# Altium project 3Phase_Power_Meter.PrjPcb
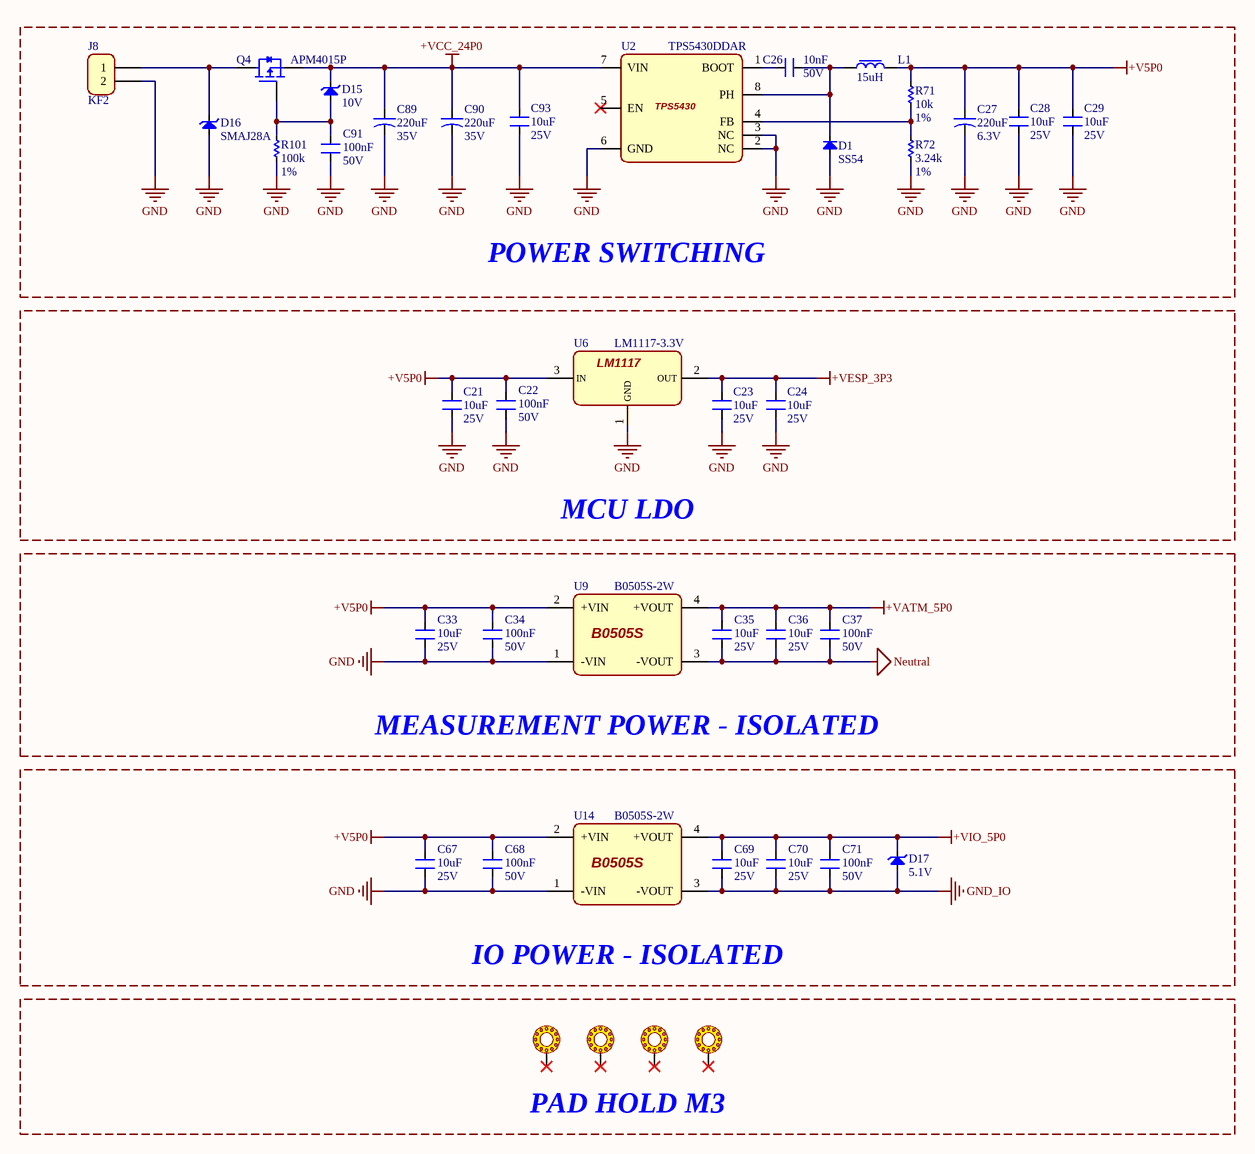
[diagram p0: Power Supply.SchDoc]
4 sheets, 252 parts. Net scope: flat (ports and power ports of the same name join across sheets).
Board file: PCB.PcbDoc
Sheets:
  Power Supply.SchDoc
  Poly Phase Metering.SchDoc
  Core.SchDoc
  Network.SchDoc

## Sheet Power Supply.SchDoc
size A3; SheetNumber: 2; SheetTotal: 6

### Parts
(Parts that share a designator on the sheet are numbered #1, #2 ... from top to bottom, then left to right.)
C21  Rating: 25V  [CAP_SMD_1206]  (hidden comment: 10uF)
C22  Rating: 50V  [CAP_SMD_0603]  (hidden comment: 100nF)
C23  Rating: 25V  [CAP_SMD_1206]  (hidden comment: 10uF)
C24  Rating: 25V  [CAP_SMD_1206]  (hidden comment: 10uF)
C26  Rating: 50V  [CAP_SMD_0603]  (hidden comment: 10nF)
C27  Rating: 6.3V  [TANT 2312]  (hidden comment: 220uF)
C28  Rating: 25V  [CAP_SMD_1206]  (hidden comment: 10uF)
C29  Rating: 25V  [CAP_SMD_1206]  (hidden comment: 10uF)
C33  Rating: 25V  [CAP_SMD_0603]  (hidden comment: 10uF)
C34  Rating: 50V  [CAP_SMD_0603]  (hidden comment: 100nF)
C35  Rating: 25V  [CAP_SMD_0603]  (hidden comment: 10uF)
C36  Rating: 25V  [CAP_SMD_0603]  (hidden comment: 10uF)
C37  Rating: 50V  [CAP_SMD_0603]  (hidden comment: 100nF)
C67  Rating: 25V  [CAP_SMD_0603]  (hidden comment: 10uF)
C68  Rating: 50V  [CAP_SMD_0603]  (hidden comment: 100nF)
C69  Rating: 25V  [CAP_SMD_0603]  (hidden comment: 10uF)
C70  Rating: 25V  [CAP_SMD_0603]  (hidden comment: 10uF)
C71  Rating: 50V  [CAP_SMD_0603]  (hidden comment: 100nF)
C89  Rating: 35V  [TANT 2312]  (hidden comment: 220uF)
C90  Rating: 35V  [TANT 2312]  (hidden comment: 220uF)
C91  Rating: 50V  [CAP_SMD_0603]  (hidden comment: 100nF)
C93  Rating: 25V  [CAP_SMD_1206]  (hidden comment: 10uF)
D1  SS54  [DIO-SMD-A]
D15  10V  [DIO-0.5A-SMALL]
D16  SMAJ28A  [DIO-SMD-A]
D17  5.1V  [DIO-0.5A-SMALL]
H1  HOLD  [M3-VIA]  (value not drawn)
H2  HOLD  [M3-VIA]  (value not drawn)
H3  HOLD  [M3-VIA]  (value not drawn)
H4  HOLD  [M3-VIA]  (value not drawn)
J8  KF2  [KF2-5.08X]
L1  15uH  [SRP7030]
Q4  APM4015P  [TO252-123]
R71  Tolerance: 1%  [RES_SMD_0603]  (hidden comment: 10k)
R72  Tolerance: 1%  [RES_SMD_0603]  (hidden comment: 3.24k)
R101#1  Tolerance: 1%  [RES_SMD_0603]  (hidden comment: 100k)
U2  TPS5430DDAR  [SOIC-8-EP]
U6  LM1117-3.3V  [SOT223-4]
U9  B0505S-2W  [SIP,19.6x7mm]
U14  B0505S-2W  [SIP,19.6x7mm]

### Blocks framed on the sheet
POWER SWITCHING: C26-C29 C89-C91 C93 D1 D15 D16 J8 L1 Q4 R71 R72 R101#1 U2
MCU LDO: C21-C24 U6
MEASUREMENT POWER - ISOLATED: C33-C37 U9
IO POWER - ISOLATED: C67-C71 D17 U14
PAD HOLD M3: H1-H4

### Nets
+V5P0: C21.1 C22.2 C27.1 C28.1 C29.1 C33.2 C34.2 C67.2 C68.2 L1.2 R71.2 U6.3(IN) U9.2(+VIN) U14.2(+VIN)
+VATM_5P0: C35.2 C36.2 C37.2 U9.4(+VOUT)
+VCC_24P0: C89.1 C90.1 C93.1 D15.2(K) Q4.2 U2.7(VIN)
+VESP_3P3: C23.1 C24.1 U6.2(OUT)
+VIO_5P0: C69.2 C70.2 C71.2 D17.2(K) U14.4(+VOUT)
GND: C21.2 C22.1 C23.2 C24.2 C27.2 C28.2 C29.2 C33.1 C34.1 C67.1 C68.1 C89.2 C90.2 C91.1 C93.2 D1.1(A) D16.1(A) J8.2 R72.1 R101#1.1 U2.2(NC) U2.3(NC) U2.6(GND) U6.1(GND) U9.1(-VIN) U14.1(-VIN)
GND_IO: C69.1 C70.1 C71.1 D17.1(A) U14.3(-VOUT)
Neutral: C35.1 C36.1 C37.1 U9.3(-VOUT)
NetC26_1: C26.1 D1.2(K) L1.1 U2.8(PH)
NetC26_2: C26.2 U2.1(BOOT)
NetC91_2: C91.2 D15.1(A) Q4.1 R101#1.2
NetD16_2: D16.2(K) J8.1 Q4.3
NetR71_1: R71.1 R72.2 U2.4(FB)

Not connected (* = marked no-connect by the designer): H1 1*; H2 1*; H3 1*; H4 1*; U2 5(EN)*

### Library data of the parts
C21-C24 C26 C28 C29 C33-C37 C67-C71 C91 C93 = CN: PN: *; LCSC: *
  C21 C23 C24 C28 C29 C33 C35 C36 C67 C69 C70 C93: Value: 10uF
  C22 C34 C37 C68 C71 C91: Value: 100nF
  C26: Value: 10nF
C27 C89 C90 = CN-TANTALUM: LCSC: *; PN: *; Value: 220uF
D1 = Diode SMD: Default Diode; LCSC: C22452; PN: SS54; Value: SS54
D15 D17 = DIODE Zener: Zenner; PN: *; LCSC: *
  D15: Value: 10V
  D17: Value: 5.1V
D16 = TVS DIODE: PN: *; LCSC: *; Value: SMAJ28A
H1-H4 = PAD_HOLD
J8 = KF2: ComponentLink1 Description: Manufacturer; ComponentLink2 Description: Datasheet; Manufacturer: *; ComponentLink1URL: http://www.we-online.com; ComponentLink2URL: http://katalog.we-online.de/em/datasheet/6911031100xx.pdf; LCSC: *; PN: *; Value: KF2
L1 = INDUCTOR: PN: MDA7030-150M; LCSC: C2847486; Value: 15uH
Q4 = FET-P: PN: *; LCSC: *; Value: APM4015P
R71 R72 R101#1 = Res-SMD: Resistor; PN: *; LCSC: *
  R71: Value: 10k
  R72: Value: 3.24k
  R101#1: Value: 100k
U2 = TPS5430: -40℃~+125℃@(TJ) 1 1.221V~32.04V 3A 4.4mA 5.5V~36V 500kHz Adjustable Buck Buck Built-in No SOIC-8-EP DC-DC Converters ROHS; LCSC: C9864; PN: TPS5430DDAR; Value: TPS5430DDAR
U6 = LM1117: 800mA Low-Dropout Linear Regulator; PN: LM1117MPX-3.3/NOPB; LCSC: C9662; Value: LM1117-3.3V
U9 U14 = B0505S: -40℃~+85℃ 1 1.5kV 100kHz 2W 4.5V~5.5V 400mA 5V 75mVp-p 84% Short Circuit Protection SIP,19.6x7mm Isolated Power Modules ROHS; LCSC: C387593; PN: B0505S-2W; Value: B0505S-2W

## Sheet Poly Phase Metering.SchDoc
size A3; SheetNumber: 3; SheetTotal: 6
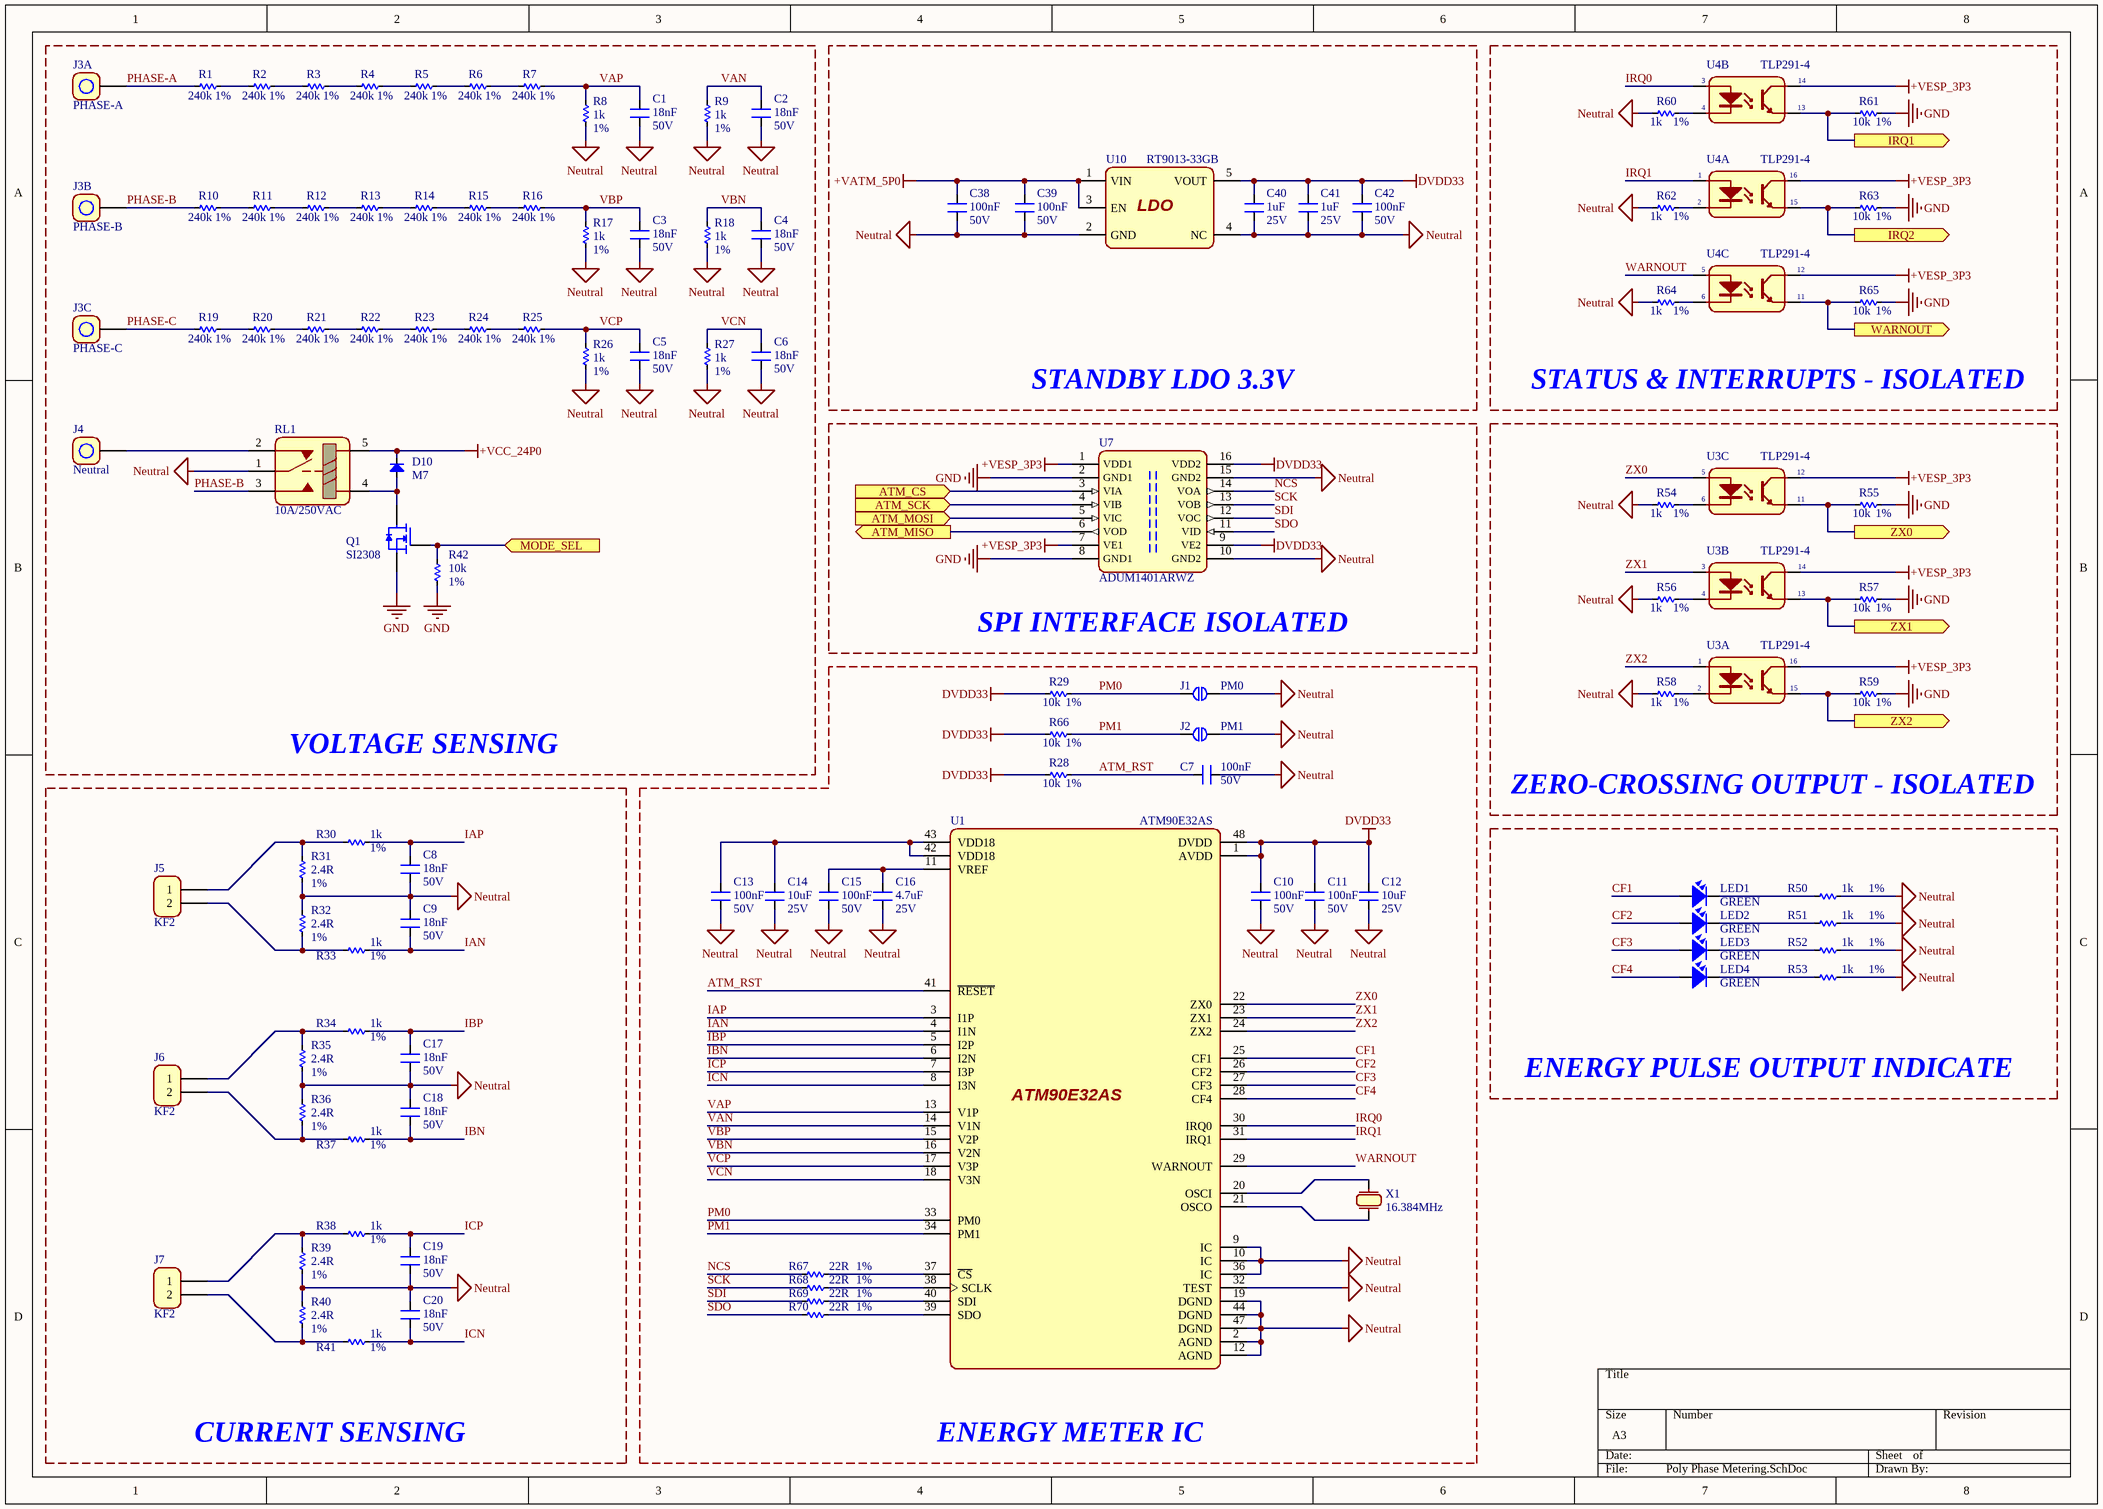
[diagram p1: Poly Phase Metering.SchDoc]

### Parts
C1  Rating: 50V  [CAP_SMD_1206]  (hidden comment: 18nF)
C2  Rating: 50V  [CAP_SMD_1206]  (hidden comment: 18nF)
C3  Rating: 50V  [CAP_SMD_1206]  (hidden comment: 18nF)
C4  Rating: 50V  [CAP_SMD_1206]  (hidden comment: 18nF)
C5  Rating: 50V  [CAP_SMD_1206]  (hidden comment: 18nF)
C6  Rating: 50V  [CAP_SMD_1206]  (hidden comment: 18nF)
C7  Rating: 50V  [CAP_SMD_0603]  (hidden comment: 100nF)
C8  Rating: 50V  [CAP_SMD_1206]  (hidden comment: 18nF)
C9  Rating: 50V  [CAP_SMD_1206]  (hidden comment: 18nF)
C10  Rating: 50V  [CAP_SMD_0603]  (hidden comment: 100nF)
C11  Rating: 50V  [CAP_SMD_0603]  (hidden comment: 100nF)
C12  Rating: 25V  [CAP_SMD_0603]  (hidden comment: 10uF)
C13  Rating: 50V  [CAP_SMD_0603]  (hidden comment: 100nF)
C14  Rating: 25V  [CAP_SMD_0603]  (hidden comment: 10uF)
C15  Rating: 50V  [CAP_SMD_0603]  (hidden comment: 100nF)
C16  Rating: 25V  [CAP_SMD_0603]  (hidden comment: 4.7uF)
C17  Rating: 50V  [CAP_SMD_1206]  (hidden comment: 18nF)
C18  Rating: 50V  [CAP_SMD_1206]  (hidden comment: 18nF)
C19  Rating: 50V  [CAP_SMD_1206]  (hidden comment: 18nF)
C20  Rating: 50V  [CAP_SMD_1206]  (hidden comment: 18nF)
C38  Rating: 50V  [CAP_SMD_0603]  (hidden comment: 100nF)
C39  Rating: 50V  [CAP_SMD_0603]  (hidden comment: 100nF)
C40  Rating: 25V  [CAP_SMD_0603]  (hidden comment: 1uF)
C41  Rating: 25V  [CAP_SMD_0603]  (hidden comment: 1uF)
C42  Rating: 50V  [CAP_SMD_0603]  (hidden comment: 100nF)
D10  M7  [DIO-SMD-A]
J1  PM0  [SOLDER_JUMP_2]
J2  PM1  [SOLDER_JUMP_2]
J3  PHASE-A  [Plugin,P=9.5mm]  (parts A,B,C of 3)
J4  Neutral  [Plugin-2,P=9.5mm]
J5  KF2  [KF2-5.08X]
J6  KF2  [KF2-5.08X]
J7  KF2  [KF2-5.08X]
LED1  GREEN  [GREENLED_0603]
LED2  GREEN  [GREENLED_0603]
LED3  GREEN  [GREENLED_0603]
LED4  GREEN  [GREENLED_0603]
Q1  SI2308  [SOT23-132]
R1  Tolerance: 1%  [RES_SMD_1206]  (hidden comment: 240k)
R2  Tolerance: 1%  [RES_SMD_1206]  (hidden comment: 240k)
R3  Tolerance: 1%  [RES_SMD_1206]  (hidden comment: 240k)
R4  Tolerance: 1%  [RES_SMD_1206]  (hidden comment: 240k)
R5  Tolerance: 1%  [RES_SMD_1206]  (hidden comment: 240k)
R6  Tolerance: 1%  [RES_SMD_1206]  (hidden comment: 240k)
R7  Tolerance: 1%  [RES_SMD_1206]  (hidden comment: 240k)
R8  Tolerance: 1%  [RES_SMD_1206]  (hidden comment: 1k)
R9  Tolerance: 1%  [RES_SMD_1206]  (hidden comment: 1k)
R10  Tolerance: 1%  [RES_SMD_1206]  (hidden comment: 240k)
R11  Tolerance: 1%  [RES_SMD_1206]  (hidden comment: 240k)
R12  Tolerance: 1%  [RES_SMD_1206]  (hidden comment: 240k)
R13  Tolerance: 1%  [RES_SMD_1206]  (hidden comment: 240k)
R14  Tolerance: 1%  [RES_SMD_1206]  (hidden comment: 240k)
R15  Tolerance: 1%  [RES_SMD_1206]  (hidden comment: 240k)
R16  Tolerance: 1%  [RES_SMD_1206]  (hidden comment: 240k)
R17  Tolerance: 1%  [RES_SMD_1206]  (hidden comment: 1k)
R18  Tolerance: 1%  [RES_SMD_1206]  (hidden comment: 1k)
R19  Tolerance: 1%  [RES_SMD_1206]  (hidden comment: 240k)
R20  Tolerance: 1%  [RES_SMD_1206]  (hidden comment: 240k)
R21  Tolerance: 1%  [RES_SMD_1206]  (hidden comment: 240k)
R22  Tolerance: 1%  [RES_SMD_1206]  (hidden comment: 240k)
R23  Tolerance: 1%  [RES_SMD_1206]  (hidden comment: 240k)
R24  Tolerance: 1%  [RES_SMD_1206]  (hidden comment: 240k)
R25  Tolerance: 1%  [RES_SMD_1206]  (hidden comment: 240k)
R26  Tolerance: 1%  [RES_SMD_1206]  (hidden comment: 1k)
R27  Tolerance: 1%  [RES_SMD_1206]  (hidden comment: 1k)
R28  Tolerance: 1%  [RES_SMD_0603]  (hidden comment: 10k)
R29  Tolerance: 1%  [RES_SMD_0603]  (hidden comment: 10k)
R30  Tolerance: 1%  [RES_SMD_1206]  (hidden comment: 1k)
R31  Tolerance: 1%  [RES_SMD_1206]  (hidden comment: 2.4R)
R32  Tolerance: 1%  [RES_SMD_1206]  (hidden comment: 2.4R)
R33  Tolerance: 1%  [RES_SMD_1206]  (hidden comment: 1k)
R34  Tolerance: 1%  [RES_SMD_1206]  (hidden comment: 1k)
R35  Tolerance: 1%  [RES_SMD_1206]  (hidden comment: 2.4R)
R36  Tolerance: 1%  [RES_SMD_1206]  (hidden comment: 2.4R)
R37  Tolerance: 1%  [RES_SMD_1206]  (hidden comment: 1k)
R38  Tolerance: 1%  [RES_SMD_1206]  (hidden comment: 1k)
R39  Tolerance: 1%  [RES_SMD_1206]  (hidden comment: 2.4R)
R40  Tolerance: 1%  [RES_SMD_1206]  (hidden comment: 2.4R)
R41  Tolerance: 1%  [RES_SMD_1206]  (hidden comment: 1k)
R42  Tolerance: 1%  [RES_SMD_0603]  (hidden comment: 10k)
R50  Tolerance: 1%  [RES_SMD_0603]  (hidden comment: 1k)
R51  Tolerance: 1%  [RES_SMD_0603]  (hidden comment: 1k)
R52  Tolerance: 1%  [RES_SMD_0603]  (hidden comment: 1k)
R53  Tolerance: 1%  [RES_SMD_0603]  (hidden comment: 1k)
R54  Tolerance: 1%  [RES_SMD_0603]  (hidden comment: 1k)
R55  Tolerance: 1%  [RES_SMD_0603]  (hidden comment: 10k)
R56  Tolerance: 1%  [RES_SMD_0603]  (hidden comment: 1k)
R57  Tolerance: 1%  [RES_SMD_0603]  (hidden comment: 10k)
R58  Tolerance: 1%  [RES_SMD_0603]  (hidden comment: 1k)
R59  Tolerance: 1%  [RES_SMD_0603]  (hidden comment: 10k)
R60  Tolerance: 1%  [RES_SMD_0603]  (hidden comment: 1k)
R61  Tolerance: 1%  [RES_SMD_0603]  (hidden comment: 10k)
R62  Tolerance: 1%  [RES_SMD_0603]  (hidden comment: 1k)
R63  Tolerance: 1%  [RES_SMD_0603]  (hidden comment: 10k)
R64  Tolerance: 1%  [RES_SMD_0603]  (hidden comment: 1k)
R65  Tolerance: 1%  [RES_SMD_0603]  (hidden comment: 10k)
R66  Tolerance: 1%  [RES_SMD_0603]  (hidden comment: 10k)
R67  Tolerance: 1%  [RES_SMD_0603]  (hidden comment: 22R)
R68  Tolerance: 1%  [RES_SMD_0603]  (hidden comment: 22R)
R69  Tolerance: 1%  [RES_SMD_0603]  (hidden comment: 22R)
R70  Tolerance: 1%  [RES_SMD_0603]  (hidden comment: 22R)
RL1  10A/250VAC  [SRA-05VDC-CL]
U1  ATM90E32AS  [TQFP48]
U3  TLP291-4  [SOP-16-4.4mm]  (parts A,B,C of 4)
U4  TLP291-4  [SOP-16-4.4mm]  (parts A,B,C of 4)
U7  ADUM1401ARWZ  [SOIC-16-300mil]
U10  RT9013-33GB  [SOT23-5]
X1  16.384MHz  [XT2-SMD]

### Blocks framed on the sheet
VOLTAGE SENSING: C1-C6 D10 J3 J4 Q1 R1-R27 R42 RL1
STANDBY LDO 3.3V: C38-C42 U10
STATUS & INTERRUPTS - ISOLATED: R60-R65 U4
SPI INTERFACE ISOLATED: U7
ZERO-CROSSING OUTPUT - ISOLATED: R54-R59 U3
ENERGY METER IC: C7 C10-C16 J1 J2 R28 R29 R66-R70 U1 X1
CURRENT SENSING: C8 C9 C17-C20 J5-J7 R30-R41
ENERGY PULSE OUTPUT INDICATE: LED1-LED4 R50-R53

### Ports
ATM_CS (in, see Architecture[4A]), ATM_MISO (out, see Architecture[4A]), ATM_MOSI (in, see Architecture[4A]), ATM_SCK (in, see Architecture[4A]), IRQ1 (out, see Architecture[4B]), IRQ2 (out, see Architecture[4B]), MODE_SEL (in, see Architecture[4A]), WARNOUT (out, see Architecture[4B]), ZX0 (out, see Architecture[4B]), ZX1 (out, see Architecture[4B]), ZX2 (out, see Architecture[4B])

### Nets
+VATM_5P0: C38.2 C39.2 U10.1(VIN) U10.3(EN)
+VCC_24P0: D10.2(K) RL1.5
+VESP_3P3: U3.12(C) U3.14(C) U3.16(C) U4.12(C) U4.14(C) U4.16(C) U7.1(VDD1) U7.7(VE1)
DVDD33: C10.2 C11.2 C12.2 C40.2 C41.2 C42.2 R28.1 R29.1 R66.1 U1.1(AVDD) U1.48(DVDD) U7.9(VE2) U7.16(VDD2) U10.5(VOUT)
GND: Q1.2 R42.2 R55.2 R57.2 R59.2 R61.2 R63.2 R65.2 U7.2(GND1) U7.8(GND1)
Neutral: C1.1 C2.1 C3.1 C4.1 C5.1 C6.1 C7.1 C8.1 C9.2 C10.1 C11.1 C12.1 C13.1 C14.1 C15.1 C16.1 C17.1 C18.2 C19.1 C20.2 C38.1 C39.1 C40.1 C41.1 C42.1 J1.2 J2.2 R8.2 R9.2 R17.2 R18.2 R26.2 R27.2 R31.2 R32.1 R35.2 R36.1 R39.2 R40.1 R50.2 R51.2 R52.2 R53.2 R54.1 R56.1 R58.1 R60.1 R62.1 R64.1 RL1.1 U1.2(AGND) U1.9(IC) U1.10(IC) U1.12(AGND) U1.19(DGND) U1.32(TEST) U1.36(IC) U1.44(DGND) U1.47(DGND) U7.10(GND2) U7.15(GND2) U10.2(GND) U10.4(NC)
ATM_RST: C7.2 R28.2 U1.41(~{RESET})
CF1: LED1.1 U1.25(CF1)
CF2: LED2.1 U1.26(CF2)
CF3: LED3.1 U1.27(CF3)
CF4: LED4.1 U1.28(CF4)
IAN: C9.1 R33.1 U1.4(I1N)
IAP: C8.2 R30.1 U1.3(I1P)
IBN: C18.1 R37.1 U1.6(I2N)
IBP: C17.2 R34.1 U1.5(I2P)
ICN: C20.1 R41.1 U1.8(I3N)
ICP: C19.2 R38.1 U1.7(I3P)
IRQ0: U1.30(IRQ0) U4.3(A)
IRQ1: U1.31(IRQ1) U4.1(A)
NCS: R67.1 U7.14(VOA)
PHASE-A: J3.1(PHASE_A) R1.2
PHASE-B: J3.2(PHASE_A) R10.2 RL1.3
PHASE-C: J3.3(PHASE_A) R19.2
PM0: J1.1 R29.2 U1.33(PM0)
PM1: J2.1 R66.2 U1.34(PM1)
SCK: R68.1 U7.13(VOB)
SDI: R69.1 U7.12(VOC)
SDO: R70.1 U7.11(VID)
VAN: C2.2 R9.1 U1.14(V1N)
VAP: C1.2 R7.1 R8.1 U1.13(V1P)
VBN: C4.2 R18.1 U1.16(V2N)
VBP: C3.2 R16.1 R17.1 U1.15(V2P)
VCN: C6.2 R27.1 U1.18(V3N)
VCP: C5.2 R25.1 R26.1 U1.17(V3P)
WARNOUT: U1.29(WARNOUT) U4.5(A)
ZX0: U1.22(ZX0) U3.5(A)
ZX1: U1.23(ZX1) U3.3(A)
ZX2: U1.24(ZX2) U3.1(A)
NetC13_2: C13.2 C14.2 U1.42(VDD18) U1.43(VDD18)
NetC15_2: C15.2 C16.2 U1.11(VREF)
NetD10_1: D10.1(A) Q1.3 RL1.4
NetJ4_1, 2: J4.1,_2(PHASE_A) RL1.2
NetJ5_1: J5.1 R30.2 R31.1
NetJ5_2: J5.2 R32.2 R33.2
NetJ6_1: J6.1 R34.2 R35.1
NetJ6_2: J6.2 R36.2 R37.2
NetJ7_1: J7.1 R38.2 R39.1
NetJ7_2: J7.2 R40.2 R41.2
NetLED1_2: LED1.2 R50.1
NetLED2_2: LED2.2 R51.1
NetLED3_2: LED3.2 R52.1
NetLED4_2: LED4.2 R53.1
NetQ1_1: Q1.1 R42.1 ; port MODE_SEL
NetR1_1: R1.1 R2.2
NetR2_1: R2.1 R3.2
NetR3_1: R3.1 R4.2
NetR4_1: R4.1 R5.2
NetR5_1: R5.1 R6.2
NetR6_1: R6.1 R7.2
NetR10_1: R10.1 R11.2
NetR11_1: R11.1 R12.2
NetR12_1: R12.1 R13.2
NetR13_1: R13.1 R14.2
NetR14_1: R14.1 R15.2
NetR15_1: R15.1 R16.2
NetR19_1: R19.1 R20.2
NetR20_1: R20.1 R21.2
NetR21_1: R21.1 R22.2
NetR22_1: R22.1 R23.2
NetR23_1: R23.1 R24.2
NetR24_1: R24.1 R25.2
NetR54_2: R54.2 U3.6(K)
NetR55_1: R55.1 U3.11(E) ; port ZX0
NetR56_2: R56.2 U3.4(K)
NetR57_1: R57.1 U3.13(E) ; port ZX1
NetR58_2: R58.2 U3.2(K)
NetR59_1: R59.1 U3.15(E) ; port ZX2
NetR60_2: R60.2 U4.4(K)
NetR61_1: R61.1 U4.13(E) ; port IRQ1
NetR62_2: R62.2 U4.2(K)
NetR63_1: R63.1 U4.15(E) ; port IRQ2
NetR64_2: R64.2 U4.6(K)
NetR65_1: R65.1 U4.11(E) ; port WARNOUT
NetR67_2: R67.2 U1.37(~{CS})
NetR68_2: R68.2 U1.38(SCLK)
NetR69_2: R69.2 U1.40(SDI)
NetR70_2: R70.2 U1.39(SDO)
NetU1_20: U1.20(OSCI) X1.2
NetU1_21: U1.21(OSCO) X1.1
NetU7_3: U7.3(VIA) ; port ATM_CS
NetU7_4: U7.4(VIB) ; port ATM_SCK
NetU7_5: U7.5(VIC) ; port ATM_MOSI
NetU7_6: U7.6(VOD) ; port ATM_MISO

### Notes on the sheet
- (in symbol RT9013) LDO

### Library data of the parts
C1-C20 C38-C42 = CN: PN: *; LCSC: *
  C1-C6 C8 C9 C17-C20: Value: 18nF
  C7 C10 C11 C13 C15 C38 C39 C42: Value: 100nF
  C12 C14: Value: 10uF
  C16: Value: 4.7uF
  C40 C41: Value: 1uF
D10 = Diode SMD: Default Diode; LCSC: *; PN: *; Value: M7
J1 J2 = CNT: DNP; PN: DNP; LCSC: DNP
  J1: Value: PM0
  J2: Value: PM1
J3 = HB9500-3: Value: PHASE-A
J4 = HB9500-2: Value: Neutral
J5-J7 = KF2: as J8 on sheet Power Supply; Manufacturer: *; ComponentLink1URL: http://www.we-online.com; ComponentLink2URL: http://katalog.we-online.de/em/datasheet/6911031100xx.pdf; LCSC: *; PN: *; Value: KF2
LED1-LED4 = LED SMD: PN: *; LCSC: *; Value: GREEN
Q1 = FET-N: PN: *; LCSC: *; Value: SI2308
R1-R42 R50-R70 = Res-SMD: Resistor; PN: *; LCSC: *
  R1-R7 R10-R16 R19-R25: Value: 240k
  R8 R9 R17 R18 R26 R27 R30 R33 R34 R37 R38 R41 R50-R54 R56 R58 R60 R62 R64: Value: 1k
  R28 R29 R42 R55 R57 R59 R61 R63 R65 R66: Value: 10k
  R31 R32 R35 R36 R39 R40: Value: 2.4R
  R67-R70: Value: 22R
RL1 = Relay 5: Relay SPDT,10A - 12VDC 5 Pin; PN: SRA-05VDC-CL; LCSC: C99666; Value: 10A/250VAC
U1 = ATM90E32AS: PN: ATM90E32AS-AU-R; LCSC: C177153; Value: ATM90E32AS
U3 U4 = TLP291-4: -55℃~+110℃ 1.2V 170mW 2.5kV 2us 3us 4 400% 400mV@2.4mA,8mA 50% 50mA 50mA 5V 80V DC Phototransistor SOP-16-4.4mm Transistor, Photovoltaic Output Optoisolators ROHS; PN: TLP291-4(GB-TP,E); LCSC: C60900; Value: TLP291-4
U7 = ADUM1401: -40℃~+125℃ 1 100ns 1Mbps 2.7V~5.5V 2.7V~5.5V 2500 25kV/us 3 SOIC-16-300mil Digital Isolators ROHS; PN: ADUM1401ARWZ; LCSC: C579384; Value: ADUM1401ARWZ
U10 = RT9013: -40℃~+125℃@(Tj) 1 25uA 3.3V 30uVrms 400mV@(500mA) 5.5V 500mA 50dB@(10kHz) Fixed Over Current Protection、Over Temperature Protection、Enable Positive SOT-23-5 Voltage Regulators - Linear, Low Drop Out (LDO) Regulators ROHS; PN: RT9013-33GB; LCSC: C47773; Value: RT9013-33GB
X1 = XT2: LCSC: *; PN: *; Value: 16.384MHz

## Sheet Core.SchDoc
size A3; SheetNumber: 4; SheetTotal: 6
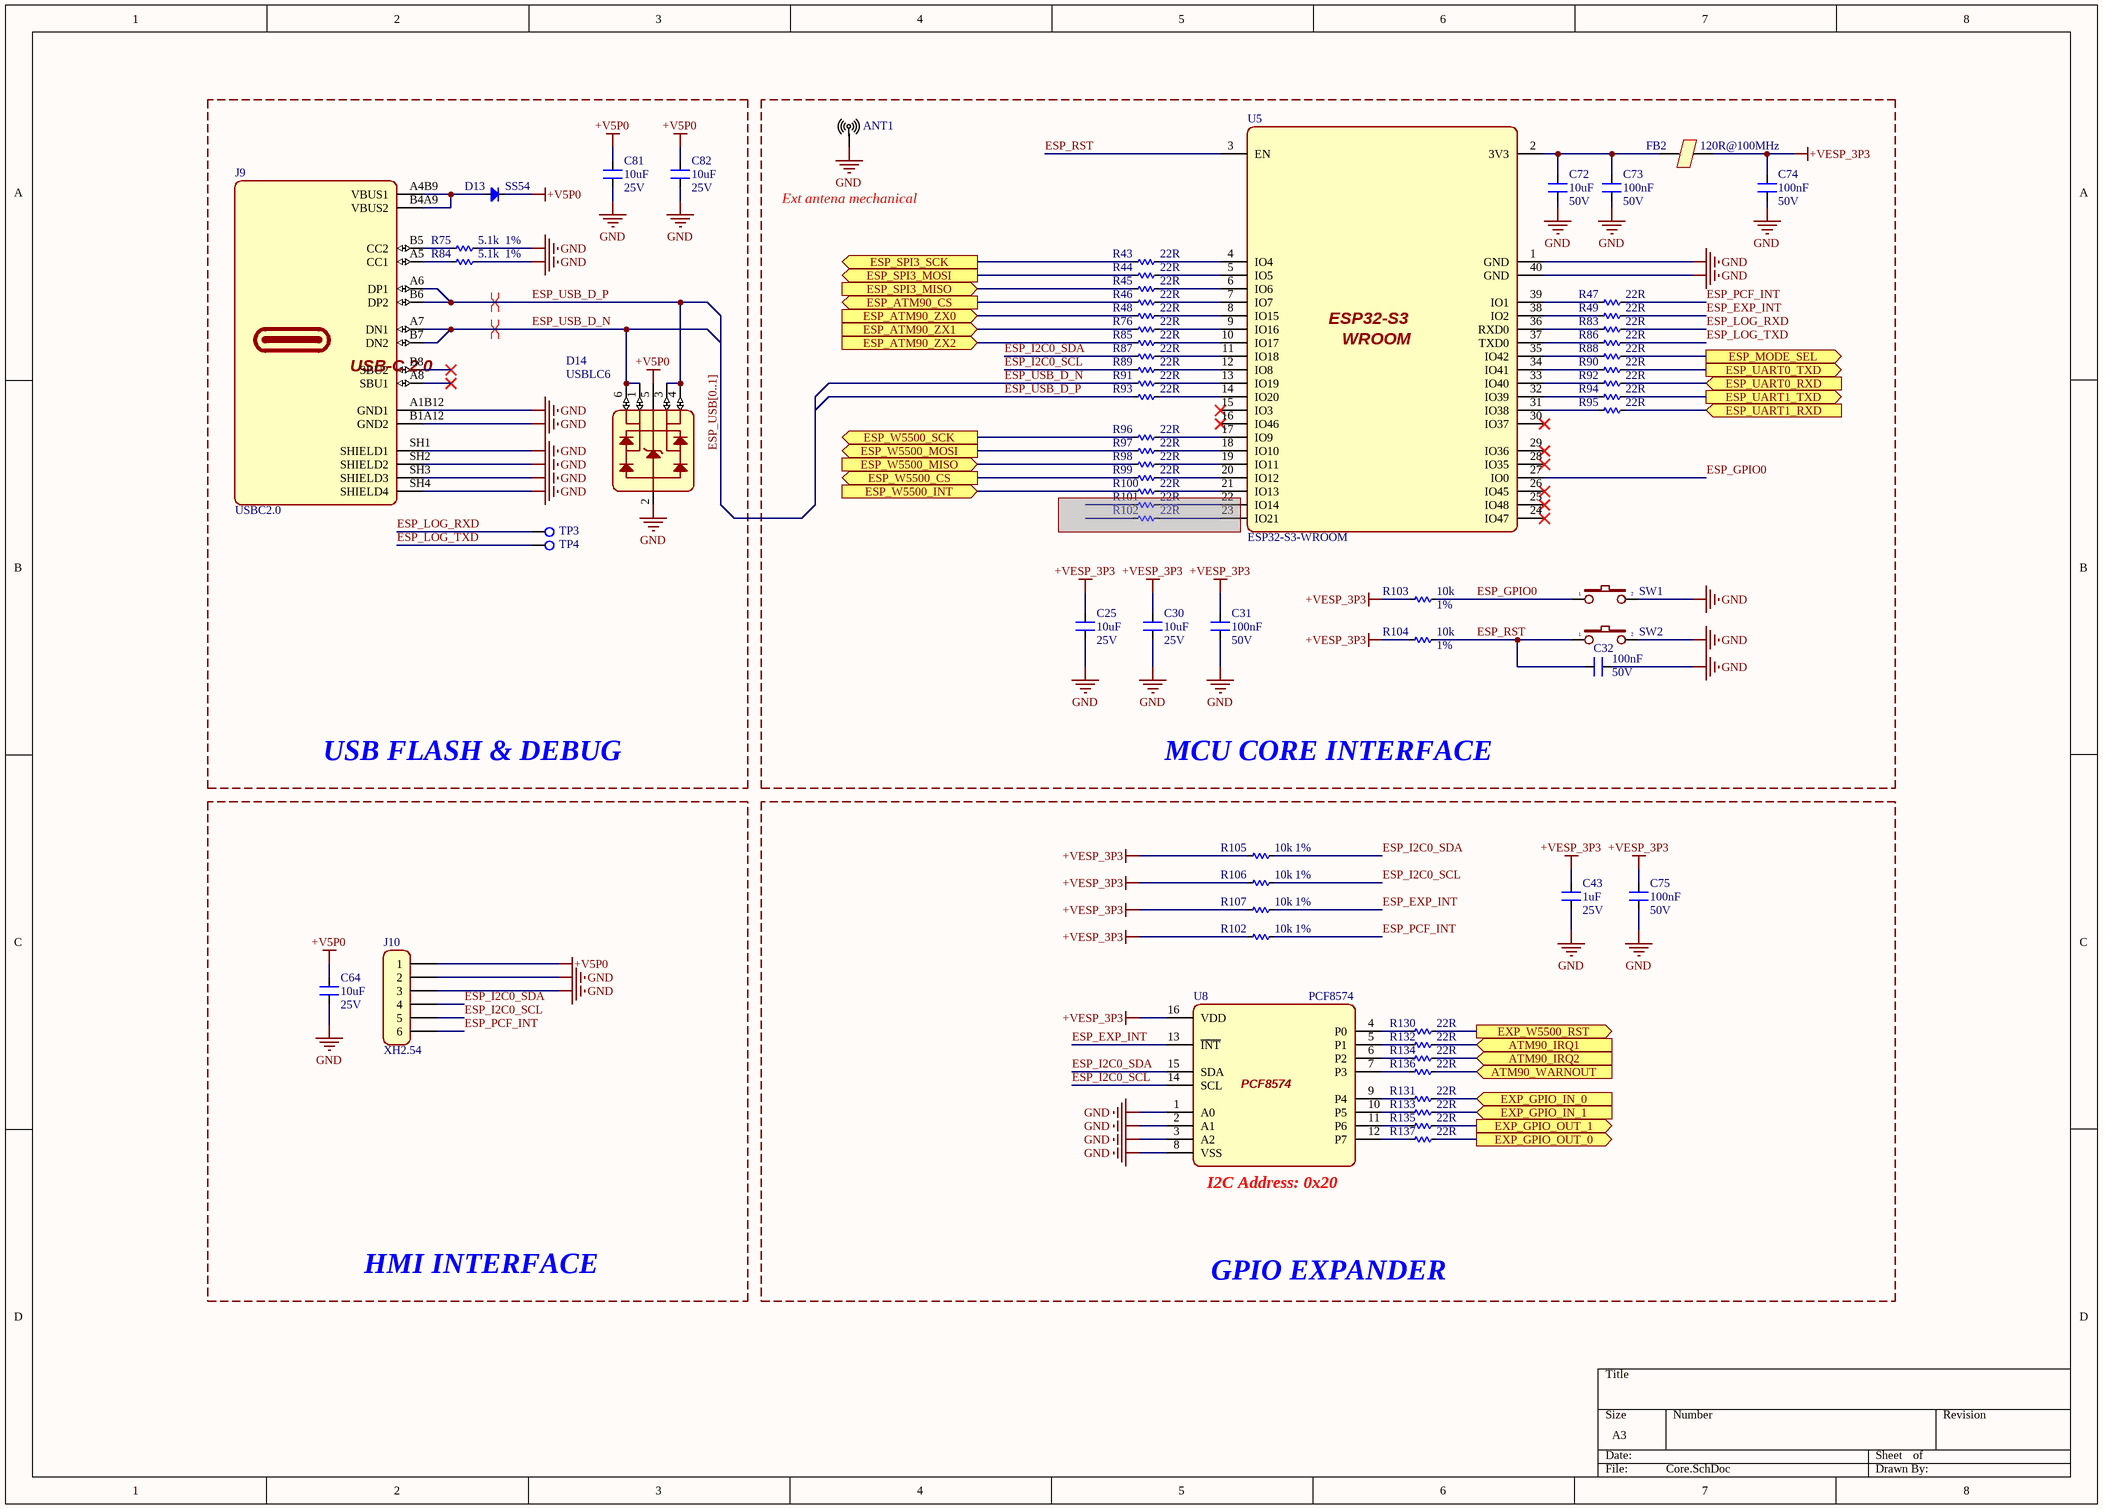
[diagram p2: Core.SchDoc]

### Parts
(Parts that share a designator on the sheet are numbered #1, #2 ... from top to bottom, then left to right.)
ANT1  Anten  [SMA-8.5mm]  (value not drawn)
C25  Rating: 25V  [CAP_SMD_0603]  (hidden comment: 10uF)
C30  Rating: 25V  [CAP_SMD_0603]  (hidden comment: 10uF)
C31  Rating: 50V  [CAP_SMD_0603]  (hidden comment: 100nF)
C32  Rating: 50V  [CAP_SMD_0603]  (hidden comment: 100nF)
C43  Rating: 25V  [CAP_SMD_0603]  (hidden comment: 1uF)
C64  Rating: 25V  [CAP_SMD_0603]  (hidden comment: 10uF)
C72  Rating: 50V  [CAP_SMD_0603]  (hidden comment: 10uF)
C73  Rating: 50V  [CAP_SMD_0603]  (hidden comment: 100nF)
C74  Rating: 50V  [CAP_SMD_0603]  (hidden comment: 100nF)
C75  Rating: 50V  [CAP_SMD_0603]  (hidden comment: 100nF)
C81  Rating: 25V  [CAP_SMD_0603]  (hidden comment: 10uF)
C82  Rating: 25V  [CAP_SMD_0603]  (hidden comment: 10uF)
D13  SS54  [DIO-SMD-A]
D14  USBLC6  [SOT23-6]
FB2  120R@100MHz  [FER 0805/2012]
J9  USBC2.0  [MOLEX-2171790001]
J10  XH2.54  [JP6-C1T]
R43  22R  [RES_SMD_0603]
R44  22R  [RES_SMD_0603]
R45  22R  [RES_SMD_0603]
R46  22R  [RES_SMD_0603]
R47  22R  [RES_SMD_0603]
R48  22R  [RES_SMD_0603]
R49  22R  [RES_SMD_0603]
R75  Tolerance: 1%  [RES_SMD_0603]  (hidden comment: 5.1k)
R76  22R  [RES_SMD_0603]
R83  22R  [RES_SMD_0603]
R84  Tolerance: 1%  [RES_SMD_0603]  (hidden comment: 5.1k)
R85  22R  [RES_SMD_0603]
R86  22R  [RES_SMD_0603]
R87  22R  [RES_SMD_0603]
R88  22R  [RES_SMD_0603]
R89  22R  [RES_SMD_0603]
R90  22R  [RES_SMD_0603]
R91  22R  [RES_SMD_0603]
R92  22R  [RES_SMD_0603]
R93  22R  [RES_SMD_0603]
R94  22R  [RES_SMD_0603]
R95  22R  [RES_SMD_0603]
R96  22R  [RES_SMD_0603]
R97  22R  [RES_SMD_0603]
R98  22R  [RES_SMD_0603]
R99  22R  [RES_SMD_0603]
R100  22R  [RES_SMD_0603]
R101#2  22R  [RES_SMD_0603]  (masked out: inside a compile mask, not in the netlist)
R102#1  22R  [RES_SMD_0603]  (masked out: inside a compile mask, not in the netlist)
R102#2  Tolerance: 1%  [RES_SMD_0603]  (hidden comment: 10k)
R103  Tolerance: 1%  [RES_SMD_0603]  (hidden comment: 10k)
R104  Tolerance: 1%  [RES_SMD_0603]  (hidden comment: 10k)
R105  Tolerance: 1%  [RES_SMD_0603]  (hidden comment: 10k)
R106  Tolerance: 1%  [RES_SMD_0603]  (hidden comment: 10k)
R107  Tolerance: 1%  [RES_SMD_0603]  (hidden comment: 10k)
R130  22R  [RES_SMD_0603]
R131  22R  [RES_SMD_0603]
R132  22R  [RES_SMD_0603]
R133  22R  [RES_SMD_0603]
R134  22R  [RES_SMD_0603]
R135  22R  [RES_SMD_0603]
R136  22R  [RES_SMD_0603]
R137  22R  [RES_SMD_0603]
SW1  SW2  [SW1-SMD]  (value not drawn)
SW2  SW2  [SW1-SMD]  (value not drawn)
TP3  Test_Point  [PAD-SMD-D2.0]  (value not drawn)
TP4  Test_Point  [PAD-SMD-D2.0]  (value not drawn)
U5  ESP32-S3-WROOM  [ESP32-S3-WROOM-1-N16R8]
U8  PCF8574  [SOIC-16-300mil]

### Blocks framed on the sheet
USB FLASH & DEBUG: C81 C82 D13 D14 J9 R75 R84 TP3 TP4
MCU CORE INTERFACE: ANT1 C25 C30-C32 C72-C74 FB2 R43-R49 R76 R83 R85-R100 R101#2 R102#1 R103 R104 SW1 SW2 U5
HMI INTERFACE: C64 J10
GPIO EXPANDER: C43 C75 R102#2 R105-R107 R130-R137 U8

### Ports
ATM90_IRQ1 (in, see Architecture[4B]), ATM90_IRQ2 (in, see Architecture[4B]), ATM90_WARNOUT (in, see Architecture[4B]), ESP_ATM90_CS (out, see Architecture[4A]), ESP_ATM90_ZX0 (in, see Architecture[4B]), ESP_ATM90_ZX1 (in, see Architecture[4B]), ESP_ATM90_ZX2 (in, see Architecture[4B]), ESP_MODE_SEL (out, see Architecture[4A]), ESP_SPI3_MISO (in, see Architecture[4A]), ESP_SPI3_MOSI (out, see Architecture[4A]), ESP_SPI3_SCK (out, see Architecture[4A]), ESP_UART0_RXD (in, see Architecture[6B]), ESP_UART0_TXD (out, see Architecture[6B]), ESP_UART1_RXD (in, see Architecture[6B]), ESP_UART1_TXD (out, see Architecture[6B]), ESP_W5500_CS (out, see Architecture[6A]), ESP_W5500_INT (in, see Architecture[6A]), ESP_W5500_MISO (in, see Architecture[6A]), ESP_W5500_MOSI (out, see Architecture[6A]), ESP_W5500_SCK (out, see Architecture[6A]), EXP_GPIO_IN_0 (in, see Architecture[6B]), EXP_GPIO_IN_1 (in, see Architecture[6B]), EXP_GPIO_OUT_0 (out, see Architecture[6B]), EXP_GPIO_OUT_1 (out, see Architecture[6B]), EXP_W5500_RST (out, see Architecture[6A])

### Nets
+V5P0: C64.1 C81.1 C82.1 D13.2(K) D14.5(VBUS) J10.1
+VESP_3P3: C25.1 C30.1 C31.1 C43.1 C74.1 C75.1 FB2.2 R102#2.1 R103.1 R104.1 R105.1 R106.1 R107.1 U8.16(VDD)
GND: ANT1.GND C25.2 C30.2 C31.2 C32.1 C43.2 C64.2 C72.2 C73.2 C74.2 C75.2 C81.2 C82.2 D14.2(GND) J9.A1B12(GND1) J9.B1A12(GND2) J9.SH1(SHIELD1) J9.SH2(SHIELD2) J9.SH3(SHIELD3) J9.SH4(SHIELD4) J10.2 J10.3 R75.2 R84.2 SW1.2 SW2.2 U5.1(GND) U5.40(GND) U8.1(A0) U8.2(A1) U8.3(A2) U8.8(VSS)
ESP_EXP_INT: R49.1 R107.2 U8.13(~{INT})
ESP_GPIO0: R103.2 SW1.1 U5.27(IO0)
ESP_I2C0_SCL: J10.5 R89.2 R106.2 U8.14(SCL)
ESP_I2C0_SDA: J10.4 R87.2 R105.2 U8.15(SDA)
ESP_LOG_RXD: R83.1 TP3.1
ESP_LOG_TXD: R86.1 TP4.1
ESP_PCF_INT: J10.6 R47.1 R102#2.2
ESP_RST: C32.2 R104.2 SW2.1 U5.3(EN)
ESP_USB_D_N: D14.1(I/O1_IN) D14.6(I/O1_OUT) J9.A7(DN1) J9.B7(DN2) R91.2
ESP_USB_D_P: D14.3(I/O2_IN) D14.4(I/O2_OUT) J9.A6(DP1) J9.B6(DP2) R93.2
NetC72_1: C72.1 C73.1 FB2.1 U5.2(3V3)
NetD13_1: D13.1(A) J9.A4B9(VBUS1) J9.B4A9(VBUS2)
NetJ9_A5: J9.A5(CC1) R84.1
NetJ9_B5: J9.B5(CC2) R75.1
NetR43_1: R43.1 U5.4(IO4)
NetR43_2: R43.2 ; port ESP_SPI3_SCK
NetR44_1: R44.1 U5.5(IO5)
NetR44_2: R44.2 ; port ESP_SPI3_MOSI
NetR45_1: R45.1 U5.6(IO6)
NetR45_2: R45.2 ; port ESP_SPI3_MISO
NetR46_1: R46.1 U5.7(IO7)
NetR46_2: R46.2 ; port ESP_ATM90_CS
NetR47_2: R47.2 U5.39(IO1)
NetR48_1: R48.1 U5.8(IO15)
NetR48_2: R48.2 ; port ESP_ATM90_ZX0
NetR49_2: R49.2 U5.38(IO2)
NetR76_1: R76.1 U5.9(IO16)
NetR76_2: R76.2 ; port ESP_ATM90_ZX1
NetR83_2: R83.2 U5.36(RXD0)
NetR85_1: R85.1 U5.10(IO17)
NetR85_2: R85.2 ; port ESP_ATM90_ZX2
NetR86_2: R86.2 U5.37(TXD0)
NetR87_1: R87.1 U5.11(IO18)
NetR88_1: R88.1 ; port ESP_MODE_SEL
NetR88_2: R88.2 U5.35(IO42)
NetR89_1: R89.1 U5.12(IO8)
NetR90_1: R90.1 ; port ESP_UART0_TXD
NetR90_2: R90.2 U5.34(IO41)
NetR91_1: R91.1 U5.13(IO19)
NetR92_1: R92.1 ; port ESP_UART0_RXD
NetR92_2: R92.2 U5.33(IO40)
NetR93_1: R93.1 U5.14(IO20)
NetR94_1: R94.1 ; port ESP_UART1_TXD
NetR94_2: R94.2 U5.32(IO39)
NetR95_1: R95.1 ; port ESP_UART1_RXD
NetR95_2: R95.2 U5.31(IO38)
NetR96_1: R96.1 U5.17(IO9)
NetR96_2: R96.2 ; port ESP_W5500_SCK
NetR97_1: R97.1 U5.18(IO10)
NetR97_2: R97.2 ; port ESP_W5500_MOSI
NetR98_1: R98.1 U5.19(IO11)
NetR98_2: R98.2 ; port ESP_W5500_MISO
NetR99_1: R99.1 U5.20(IO12)
NetR99_2: R99.2 ; port ESP_W5500_CS
NetR100_1: R100.1 U5.21(IO13)
NetR100_2: R100.2 ; port ESP_W5500_INT
NetR130_1: R130.1 ; port EXP_W5500_RST
NetR130_2: R130.2 U8.4(P0)
NetR131_1: R131.1 ; port EXP_GPIO_IN_0
NetR131_2: R131.2 U8.9(P4)
NetR132_1: R132.1 ; port ATM90_IRQ1
NetR132_2: R132.2 U8.5(P1)
NetR133_1: R133.1 ; port EXP_GPIO_IN_1
NetR133_2: R133.2 U8.10(P5)
NetR134_1: R134.1 ; port ATM90_IRQ2
NetR134_2: R134.2 U8.6(P2)
NetR135_1: R135.1 ; port EXP_GPIO_OUT_1
NetR135_2: R135.2 U8.11(P6)
NetR136_1: R136.1 ; port ATM90_WARNOUT
NetR136_2: R136.2 U8.7(P3)
NetR137_1: R137.1 ; port EXP_GPIO_OUT_0
NetR137_2: R137.2 U8.12(P7)

Not connected (* = marked no-connect by the designer): J9 A8(SBU1)* B8(SBU2)*; U5 15(IO3)* 16(IO46)* 22(IO14) 23(IO21) 24(IO47)* 25(IO48)* 26(IO45)* 28(IO35)* 29(IO36)* 30(IO37)*

### Buses and harness runs
bus ESP_USB[0..1]

### Layout directives
differential pair; differential pair class USB 90R: ESP_USB_D_N, ESP_USB_D_P

### Notes on the sheet
- Ext antena mechanical
- (near U8) I2C Address: 0x20
- (in symbol ESP32-S3-WROOM) ESP32-S3; WROOM
- (in symbol USBC-2.0) USB-C 2.0

### Library data of the parts
ANT1 = Anten Mechanical
C25 C30-C32 C43 C64 C72-C75 C81 C82 = CN: PN: *; LCSC: *
  C25 C30 C64 C72 C81 C82: Value: 10uF
  C31 C32 C73-C75: Value: 100nF
  C43: Value: 1uF
D13 = Diode SMD: Default Diode; LCSC: C22452; PN: SS54; Value: SS54
D14 = USBLC6: TVS DIODE 5.25VWM 17VC SOT23-6
FB2 = FERRITE BEAD: PN: CBW201209U121T; LCSC: C139186; Value: 120R@100MHz
J9 = USBC-2.0: USB Type C - Connector, Top-mount SMT, 16pos | Molex Incorporated 217179-0001; PN: 2171790001; LCSC: C3197684; Value: USBC2.0
J10 = JP6: ComponentLink1 Description: Manufacturer; ComponentLink2 Description: Datasheet; ComponentLink1URL: http://www.we-online.com; ComponentLink2URL: http://katalog.we-online.de/em/datasheet/6130xx143121.pdf; PN: *; LCSC: *; Value: XH2.54
R43-R49 R76 R83 R85-R100 R101#2 R102#1 R130-R137 = Res-SMD: Resistor; Tolerance: 1%; PN: *; LCSC: *; Value: 22R
R75 R84 R102#2 R103-R107 = Res-SMD: Resistor; PN: *; LCSC: *
  R75 R84: Value: 5.1k
  R102#2 R103-R107: Value: 10k
SW1 SW2 = SW2: Switch button 2 pin; PN: B3U-3000P; LCSC: C963349; Value: SW2
U5 = ESP32-S3-WROOM: -103.5dBm -40℃~+65℃ 2.4GHz 20.5dBm 355mA 3V~3.6V 95mA ESP32-S3R8 On-board PCB Antenna UART、SPI、I2C、GPIO、I2S、USB SMD,25.5x18mm WiFi Modules ROHS; LCSC: C2913202; PN: ESP32-S3-WROOM-1-N16R8; Value: ESP32-S3-WROOM
U8 = PCF8574: -40℃~+85℃ 100kHz 10mA 16 2.5V~6V 2.5uA 30uA 8 I2C Interrupt Output Reset function、Cascading and address extension、Built-in LED driver SOIC-16-300mil I/O Expanders ROHS; PN: PCF8574T/3,518; LCSC: C7605; Value: PCF8574

## Sheet Network.SchDoc
size A3; SheetNumber: 6; SheetTotal: 7
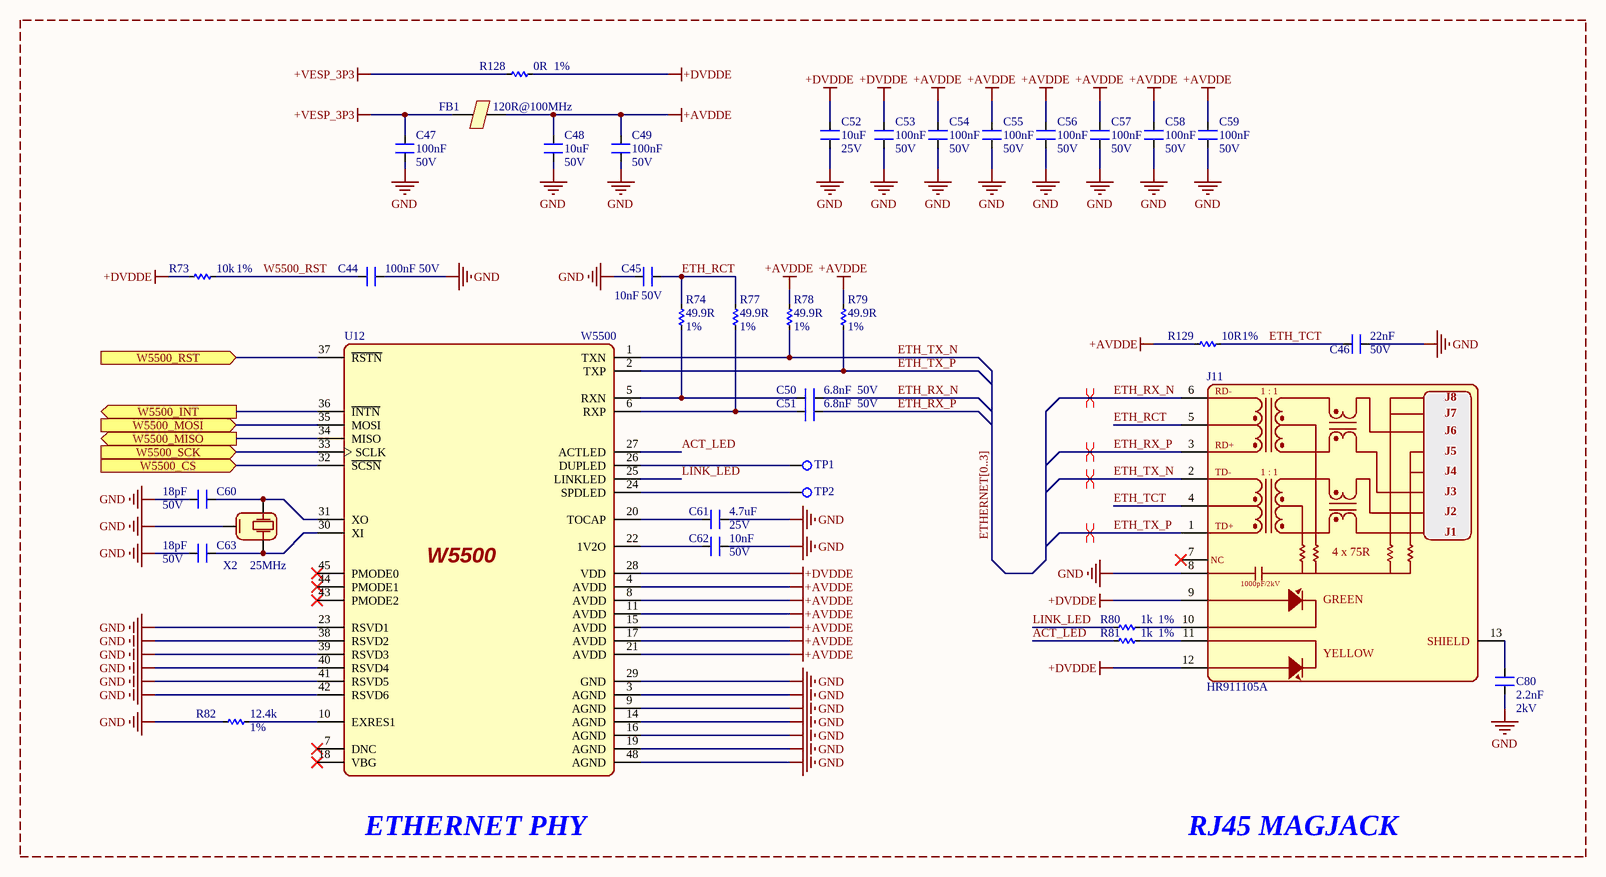
[diagram p3: Network.SchDoc]

### Parts
C44  Rating: 50V  [CAP_SMD_0603]  (hidden comment: 100nF)
C45  Rating: 50V  [CAP_SMD_0603]  (hidden comment: 10nF)
C46  Rating: 50V  [CAP_SMD_0603]  (hidden comment: 22nF)
C47  Rating: 50V  [CAP_SMD_0603]  (hidden comment: 100nF)
C48  Rating: 50V  [CAP_SMD_0603]  (hidden comment: 10uF)
C49  Rating: 50V  [CAP_SMD_0603]  (hidden comment: 100nF)
C50  Rating: 50V  [CAP_SMD_0603]  (hidden comment: 6.8nF)
C51  Rating: 50V  [CAP_SMD_0603]  (hidden comment: 6.8nF)
C52  Rating: 25V  [CAP_SMD_0603]  (hidden comment: 10uF)
C53  Rating: 50V  [CAP_SMD_0603]  (hidden comment: 100nF)
C54  Rating: 50V  [CAP_SMD_0603]  (hidden comment: 100nF)
C55  Rating: 50V  [CAP_SMD_0603]  (hidden comment: 100nF)
C56  Rating: 50V  [CAP_SMD_0603]  (hidden comment: 100nF)
C57  Rating: 50V  [CAP_SMD_0603]  (hidden comment: 100nF)
C58  Rating: 50V  [CAP_SMD_0603]  (hidden comment: 100nF)
C59  Rating: 50V  [CAP_SMD_0603]  (hidden comment: 100nF)
C60  Rating: 50V  [CAP_SMD_0603]  (hidden comment: 18pF)
C61  Rating: 25V  [CAP_SMD_0603]  (hidden comment: 4.7uF)
C62  Rating: 50V  [CAP_SMD_0603]  (hidden comment: 10nF)
C63  Rating: 50V  [CAP_SMD_0603]  (hidden comment: 18pF)
C80  Rating: 2kV  [CAP_SMD_1206]  (hidden comment: 2.2nF)
FB1  120R@100MHz  [FER 0805/2012]
J11  HR911105A  [HR911105A]
R73  Tolerance: 1%  [RES_SMD_0603]  (hidden comment: 10k)
R74  Tolerance: 1%  [RES_SMD_0603]  (hidden comment: 49.9R)
R77  Tolerance: 1%  [RES_SMD_0603]  (hidden comment: 49.9R)
R78  Tolerance: 1%  [RES_SMD_0603]  (hidden comment: 49.9R)
R79  Tolerance: 1%  [RES_SMD_0603]  (hidden comment: 49.9R)
R80  Tolerance: 1%  [RES_SMD_0603]  (hidden comment: 1k)
R81  Tolerance: 1%  [RES_SMD_0603]  (hidden comment: 1k)
R82  Tolerance: 1%  [RES_SMD_0603]  (hidden comment: 12.4k)
R128  Tolerance: 1%  [RES_SMD_0603]  (hidden comment: 0R)
R129  Tolerance: 1%  [RES_SMD_0603]  (hidden comment: 10R)
TP1  Test_Point  [PAD-SMD-D1.0]  (value not drawn)
TP2  Test_Point  [PAD-SMD-D1.0]  (value not drawn)
U12  W5500  [LQFP-48(7x7)]
X2  25MHz  [XT4-SMD]

### Ports
W5500_CS (in, see Architecture[6A]), W5500_INT (out, see Architecture[6A]), W5500_MISO (out, see Architecture[6A]), W5500_MOSI (in, see Architecture[6A]), W5500_RST (in, see Architecture[6A]), W5500_SCK (in, see Architecture[6A])

### Nets
+AVDDE: C48.1 C49.1 C54.1 C55.1 C56.1 C57.1 C58.1 C59.1 FB1.2 R78.2 R79.2 R129.1 U12.4(AVDD) U12.8(AVDD) U12.11(AVDD) U12.15(AVDD) U12.17(AVDD) U12.21(AVDD)
+DVDDE: C52.1 C53.1 J11.9 J11.12 R73.1 R128.2 U12.28(VDD)
+VESP_3P3: C47.1 FB1.1 R128.1
GND: C44.1 C45.2 C46.1 C47.2 C48.2 C49.2 C52.2 C53.2 C54.2 C55.2 C56.2 C57.2 C58.2 C59.2 C60.2 C61.1 C62.1 C63.2 C80.2 J11.8 R82.2 U12.3(AGND) U12.9(AGND) U12.14(AGND) U12.16(AGND) U12.19(AGND) U12.23(RSVD1) U12.29(GND) U12.38(RSVD2) U12.39(RSVD3) U12.40(RSVD4) U12.41(RSVD5) U12.42(RSVD6) U12.48(AGND) X2.2,4(GND)
ACT_LED: R81.2 U12.27(ACTLED)
ETH_RCT: C45.1 J11.5 R74.2 R77.2
ETH_RX_N: C50.1 J11.6
ETH_RX_P: C51.1 J11.3
ETH_TCT: C46.2 J11.4 R129.2
ETH_TX_N: J11.2 R78.1 U12.1(TXN)
ETH_TX_P: J11.1 R79.1 U12.2(TXP)
LINK_LED: R80.2 U12.25(LINKLED)
W5500_RST: C44.2 R73.2
NetC50_2: C50.2 R74.1 U12.5(RXN)
NetC51_2: C51.2 R77.1 U12.6(RXP)
NetC60_1: C60.1 U12.31(XO) X2.1(XTAL)
NetC61_2: C61.2 U12.20(TOCAP)
NetC62_2: C62.2 U12.22(1V2O)
NetC63_1: C63.1 U12.30(XI) X2.3(XTAL)
NetC80_1: C80.1 J11.13(SHIELD)
NetJ11_10: J11.10 R80.1
NetJ11_11: J11.11 R81.1
NetR82_1: R82.1 U12.10(EXRES1)
NetTP1_1: TP1.1 U12.26(DUPLED)
NetTP2_1: TP2.1 U12.24(SPDLED)
NetU12_32: U12.32(~{SCSN}) ; port W5500_CS
NetU12_33: U12.33(SCLK) ; port W5500_SCK
NetU12_34: U12.34(MISO) ; port W5500_MISO
NetU12_35: U12.35(MOSI) ; port W5500_MOSI
NetU12_36: U12.36(~{INTN}) ; port W5500_INT
NetU12_37: U12.37(~{RSTN}) ; port W5500_RST

Not connected (* = marked no-connect by the designer): J11 7(NC)*; U12 7(DNC)* 18(VBG)* 43(PMODE2)* 44(PMODE1)* 45(PMODE0)*

### Buses and harness runs
bus ETHERNET[0..3]

### Layout directives
differential pair; differential pair class ETH 100R: ETH_RX_N, ETH_RX_P, ETH_TX_N, ETH_TX_P

### Notes on the sheet
- (near U12) ETHERNET PHY
- RJ45 MAGJACK
- (in symbol RJ45_10/100) RD-; 1 : 1; J8; J7; J6; RD+; J5; TD-; J4; J3; J2; TD+; J1; 4 x 75R; 1000pF/2kV; GREEN; YELLOW

### Library data of the parts
C44-C63 C80 = CN: PN: *; LCSC: *
  C44 C47 C49 C53-C59: Value: 100nF
  C45 C62: Value: 10nF
  C46: Value: 22nF
  C48 C52: Value: 10uF
  C50 C51: Value: 6.8nF
  C60 C63: Value: 18pF
  C61: Value: 4.7uF
  C80: Value: 2.2nF
FB1 = FERRITE BEAD: PN: CBW201209U121T; LCSC: C139186; Value: 120R@100MHz
J11 = RJ45_10/100: PN: HR911105A; LCSC: C12074; Value: HR911105A
R73 R74 R77-R82 R128 R129 = Res-SMD: Resistor; PN: *; LCSC: *
  R73: Value: 10k
  R74 R77-R79: Value: 49.9R
  R80 R81: Value: 1k
  R82: Value: 12.4k
  R128: Value: 0R
  R129: Value: 10R
U12 = W5500: -40℃~+85℃ 10BASE-T、100BASE-TX 3.3V 32KB 8 SPI SPI Yes LQFP-48(7x7) Ethernet Controllers ROHS; PN: W5500; LCSC: C32843; Value: W5500
X2 = XT4: Crystal, 16 MHz, -30 to 85 degC, 3.2 x 2.5 x 0.9 mm SMD; PN: *; LCSC: *; Value: 25MHz

## Nets that join several sheets
+V5P0: Power Supply (14 pins), Core (6 pins)
+VATM_5P0: Power Supply (C35.2 C36.2 C37.2 U9.4), Poly Phase Metering (C38.2 C39.2 U10.1 U10.3)
+VCC_24P0: Power Supply (6 pins), Poly Phase Metering (D10.2 RL1.5)
+VESP_3P3: Power Supply (C23.1 C24.1 U6.2), Poly Phase Metering (8 pins), Core (14 pins), Network (C47.1 FB1.1 R128.1)
GND: Power Supply (26 pins), Poly Phase Metering (10 pins), Core (32 pins), Network (35 pins)
Neutral: Power Supply (C35.1 C36.1 C37.1 U9.3), Poly Phase Metering (63 pins)